# EAGLE design SatNOGSBoardV1 (EAGLE 6.4)
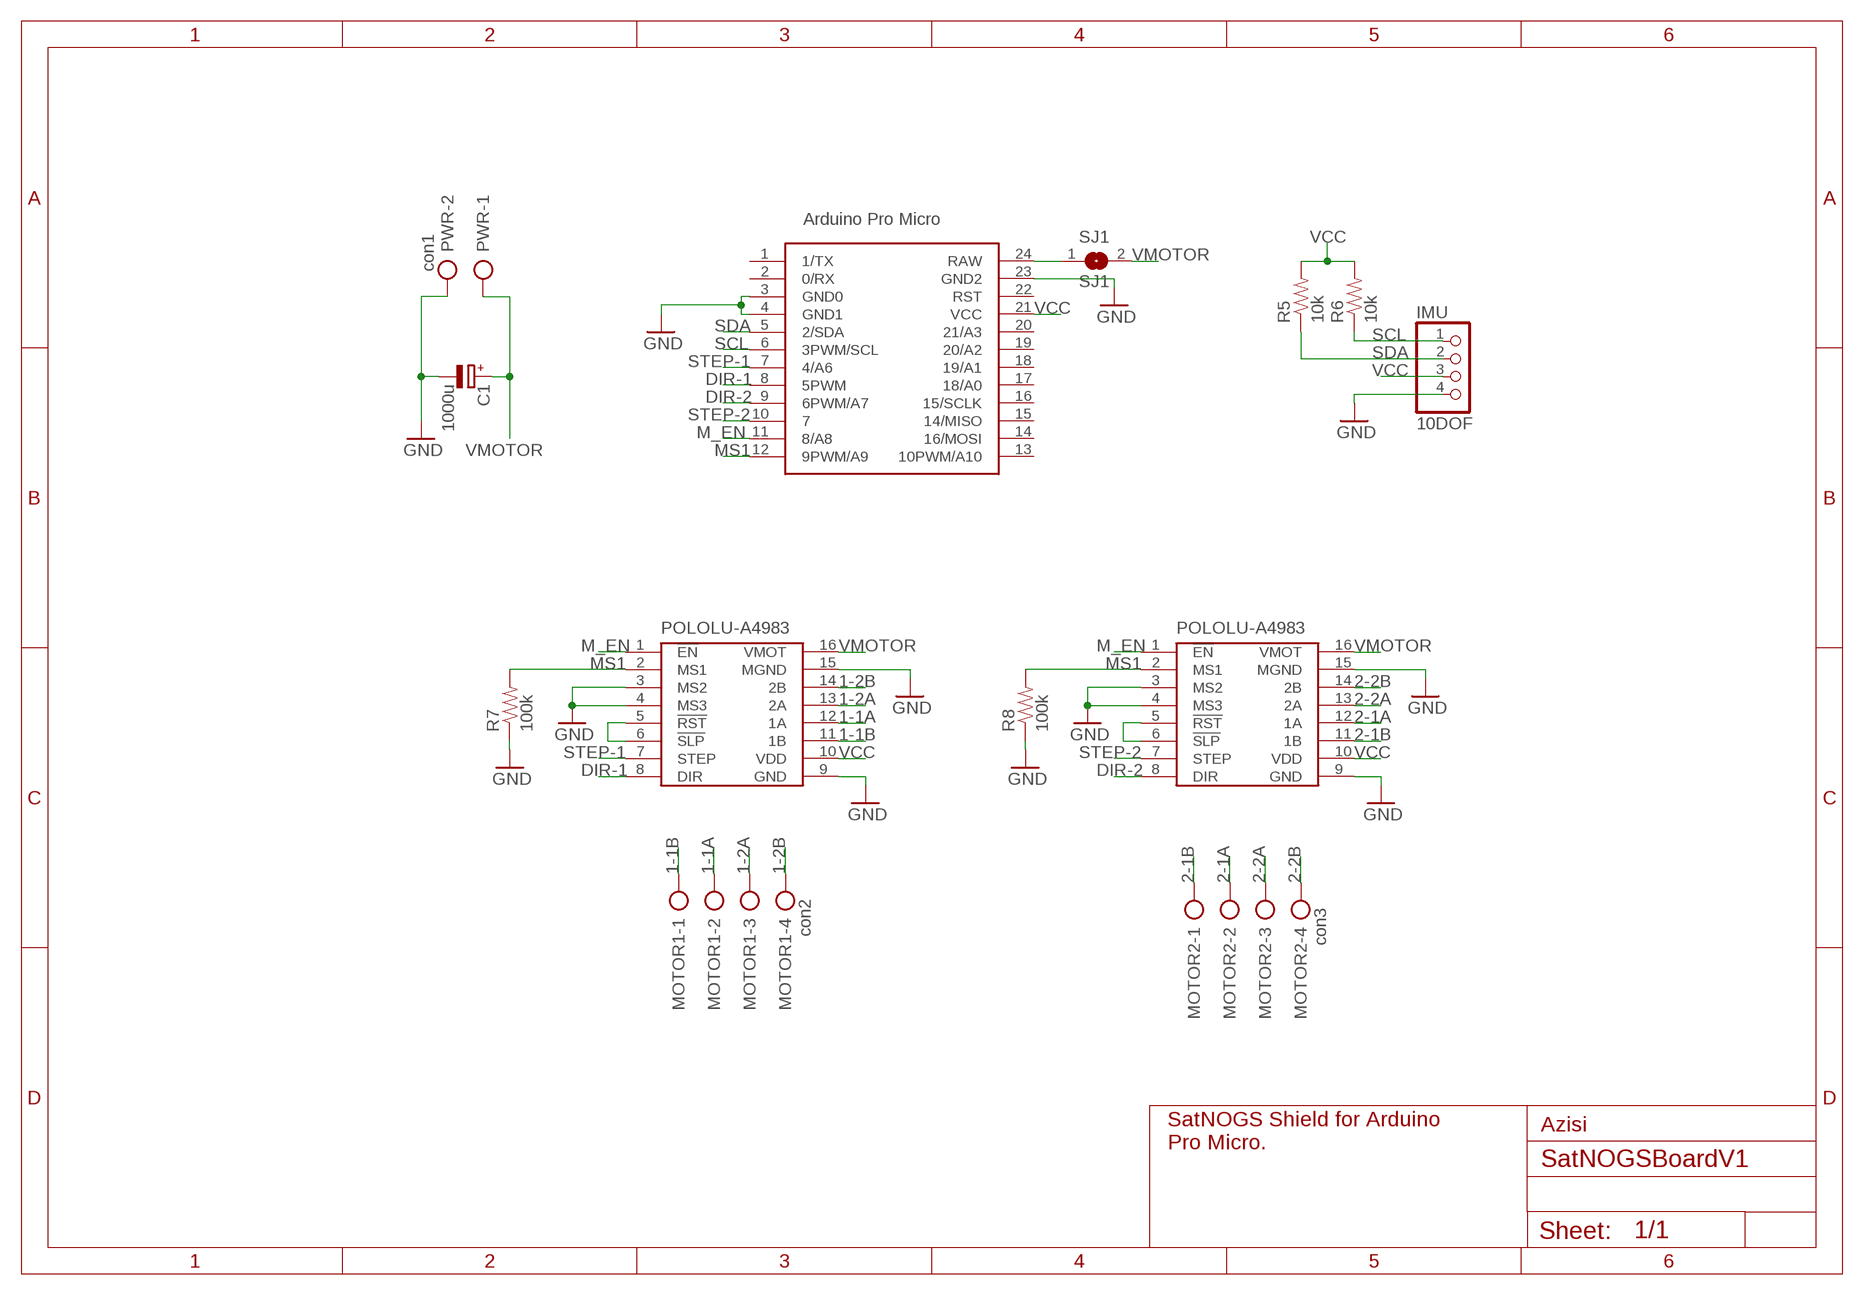
[diagram p0: schematic, sheet 1]

## Parts
C1  1000u  CPOL-EUE5-8.5  [E5-8,5]
DRIVER1  POLOLU-A4983POLOLU-A4983  [POLOLU-A4983]
DRIVER2  POLOLU-A4983POLOLU-A4983  [POLOLU-A4983]
IMU  10DOF  PINHD-1X4/90  [1X04/90]
MOTOR1  con2  AK500/4  [AK500/4]
MOTOR2  con3  AK500/4  [AK500/4]
PWR  con1  AK500/2  [AK500/2]
R5  10k  RESISTORPTH-1/4W  [AXIAL-0.4]
R6  10k  RESISTORPTH-1/4W  [AXIAL-0.4]
R7  100k  RESISTORPTH-1/4W  [AXIAL-0.4]
R8  100k  RESISTORPTH-1/4W  [AXIAL-0.4]
SJ1  SJ1  SJW  [SJW]
UC  ARDUINO_PRO_MICROARDUINO_BOARD  [ARDUINO_MICRO_PRO]

## Nets
1-1A: DRIVER1.12(1A) MOTOR1.2
1-1B: DRIVER1.11(1B) MOTOR1.1
1-2A: DRIVER1.13(2A) MOTOR1.3
1-2B: DRIVER1.14(2B) MOTOR1.4
2-1A: DRIVER2.12(1A) MOTOR2.2
2-1B: DRIVER2.11(1B) MOTOR2.1
2-2A: DRIVER2.13(2A) MOTOR2.3
2-2B: DRIVER2.14(2B) MOTOR2.4
DIR-1: DRIVER1.8(DIR) UC.8(5PWM)
DIR-2: DRIVER2.8(DIR) UC.9(6PWM/A7)
GND: C1.- DRIVER1.3(MS2) DRIVER1.4(MS3) DRIVER1.9(GND) DRIVER1.15(MGND) DRIVER2.3(MS2) DRIVER2.4(MS3) DRIVER2.9(GND) DRIVER2.15(MGND) IMU.4 PWR.2 R7.P$1 R8.P$1 UC.3(GND0) UC.4(GND1) UC.23(GND2)
M_EN: DRIVER1.1(!EN) DRIVER2.1(!EN) UC.11(8/A8)
MS1: DRIVER1.2(MS1) DRIVER2.2(MS1) R7.P$2 R8.P$2 UC.12(9PWM/A9)
N$1: DRIVER1.5(!RST) DRIVER1.6(!SLP)
N$2: DRIVER2.5(!RST) DRIVER2.6(!SLP)
N$3: SJ1.1 UC.24(RAW)
SCL: IMU.1 R6.P$1 UC.6(3PWM/SCL)
SDA: IMU.2 R5.P$1 UC.5(2/SDA)
STEP-1: DRIVER1.7(STEP) UC.7(4/A6)
STEP-2: DRIVER2.7(STEP) UC.10
VCC: DRIVER1.10(VDD) DRIVER2.10(VDD) IMU.3 R5.P$2 R6.P$2 UC.21(VCC)
VMOTOR: C1.+ DRIVER1.16(VMOT) DRIVER2.16(VMOT) PWR.1 SJ1.2
Unconnected: UC.1(1/TX) UC.2(0/RX) UC.13(10PWM/A10) UC.14(16/MOSI) UC.15(14/MISO) UC.16(15/SCLK) UC.17(18/A0) UC.18(19/A1) UC.19(20/A2) UC.20(21/A3) UC.22(RST)

## Notes on the sheet
- Azisi
- SatNOGS Shield for Arduino
  Pro Micro.

## Library data of the parts
C1 = rcl:CPOL-EU: POLARIZED CAPACITOR, European symbol
DRIVER1 DRIVER2 = Pololu-A4983:POLOLU-A4983
IMU = pinhead:PINHD-1X4: PIN HEADER
MOTOR1 MOTOR2 = con-ptr500:AK500/4: CONNECTOR; OC_FARNELL: unknown; OC_NEWARK: unknown
PWR = con-ptr500:AK500/2: CONNECTOR; OC_FARNELL: unknown; OC_NEWARK: unknown
R5-R8 = SparkFun-Resistors:RESISTOR: Resistor Basic schematic elements and footprints for 0603, 1206, and PTH resistors.
SJ1 = jumper:SJ: SMD solder JUMPER
UC = Arduino_Pro_Micro:ARDUINO_PRO_MICRO

## Board
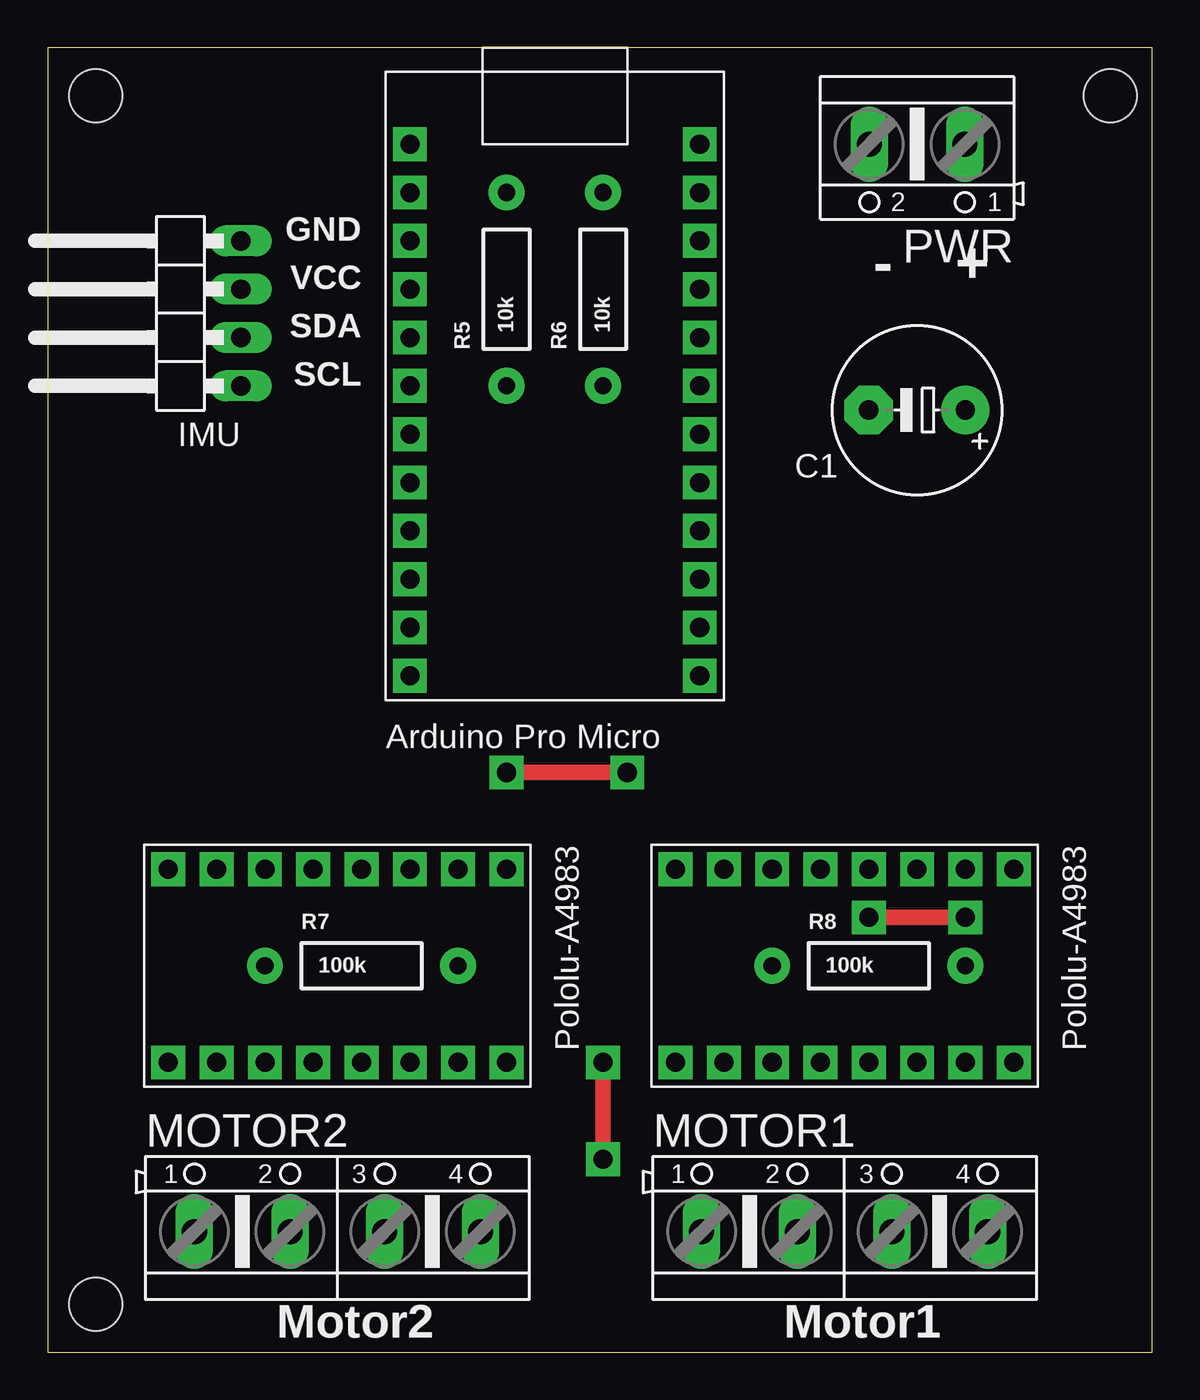
[diagram p1: board, top side]
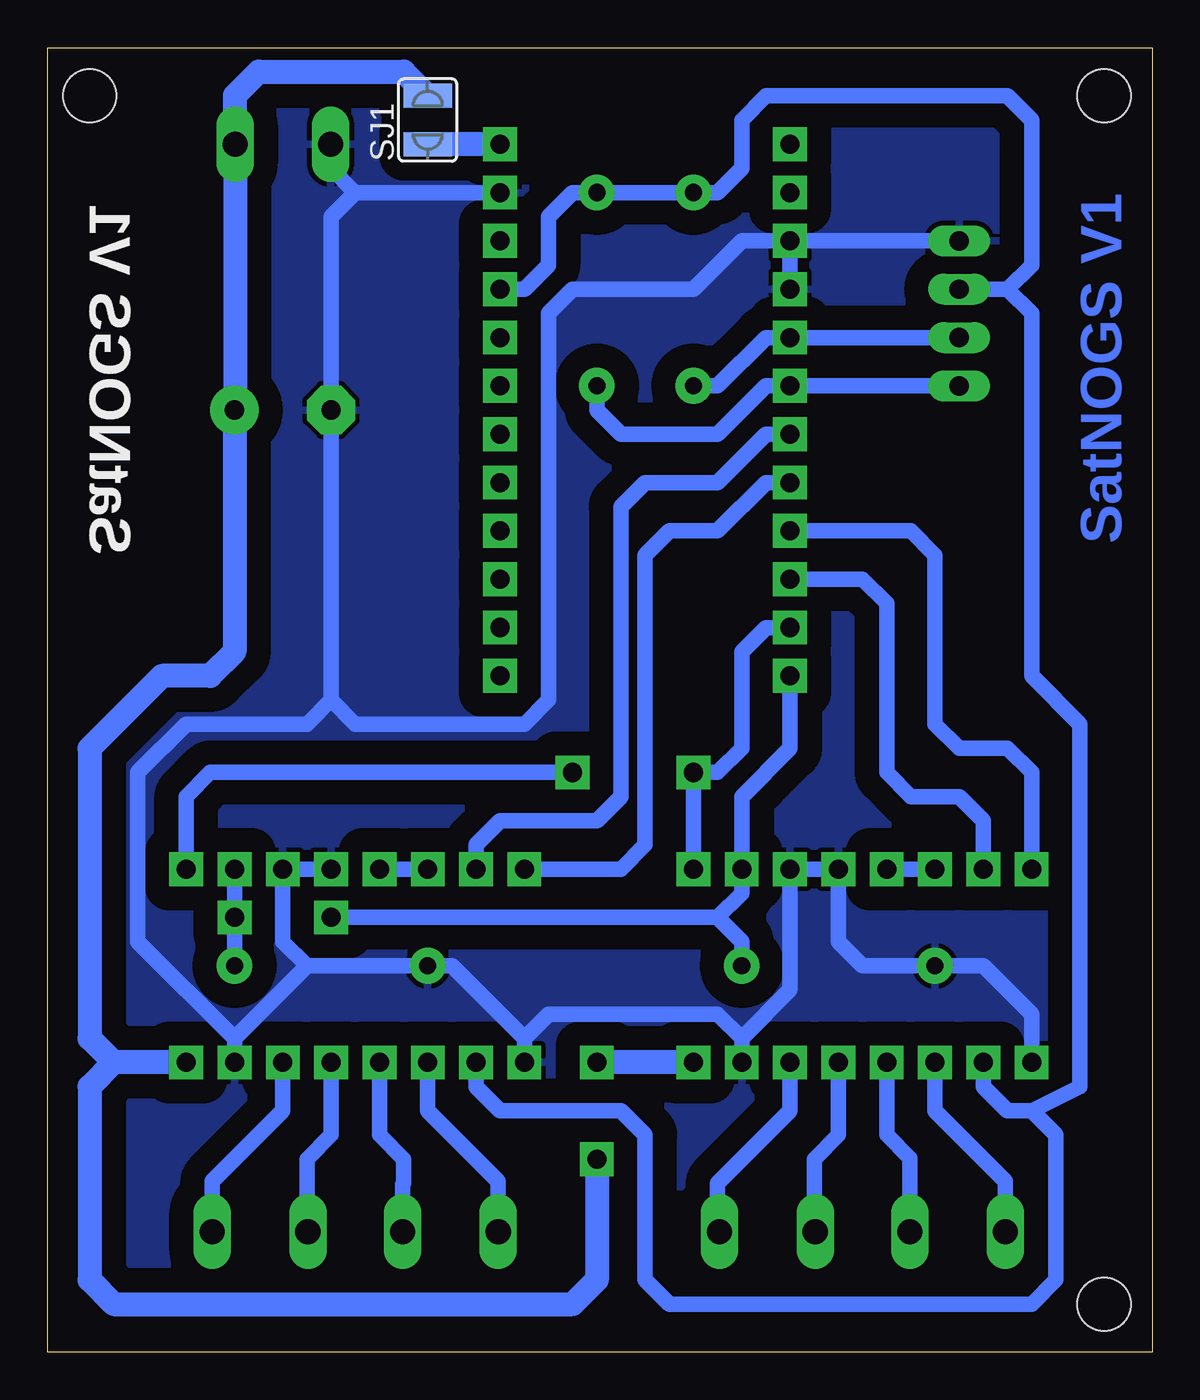
[diagram p2: board, bottom side, seen from below]

Size 58.09 x 68.57 mm. Coordinates in mm from the lower left corner, seen from the top.
Outline: 0,0 58.09,0 58.09,68.57 0,68.57 0,0
Copper layers (1*16): Top 0.035mm / dielectric 1.5mm / Bottom 0.035mm
Design rules "SparkFun": minimum track width 8mil, minimum drill 20mil, track to track 8mil, track to pad 8mil, pad to pad 8mil, via to via 8mil, smd to smd 8mil, copper to edge 8mil, drill to drill 8mil, minimum pad ring 12mil, minimum via ring 10mil, stop-mask expansion 4mil, vias tented up to drill 20mil, thermal gap 10mil
Holes 2.8 mm at 2.54,66.04 55.88,66.04 2.54,2.54

### Footprints (pad centres in the part's own frame; a part is rotated, then mirrored left to right if it is on the bottom)
E5-8,5 = drill 1.016 pad 2.54: + -2.54,0 | drill 1.016 pad 2.54 octagon: - 2.54,0
POLOLU-A4983 = drill 1 pad 1.778 square: 1 -5.08,8.89; 2 -5.08,6.35; 3 -5.08,3.81; 4 -5.08,1.27; 5 -5.08,-1.27; 6 -5.08,-3.81; 7 -5.08,-6.35; 8 -5.08,-8.89; 9 5.08,-8.89; 10 5.08,-6.35; 11 5.08,-3.81; 12 5.08,-1.27; 13 5.08,1.27; 14 5.08,3.81; 15 5.08,6.35; 16 5.08,8.89
1X04/90 = drill 1.016 long: 1 -3.81,-3.81; 2 -1.27,-3.81; 3 1.27,-3.81; 4 3.81,-3.81
AK500/4 = drill 1.321 long: 1 -7.518,0; 2 -2.489,0; 3 2.489,0; 4 7.518,0
AK500/2 = drill 1.321 long: 1 -2.515,0; 2 2.515,0
AXIAL-0.4 = drill 0.9 pad 1.88: P$1 -5.08,0; P$2 5.08,0
SJW = smd 1.27 x 2.54: 1 -1.27,0; 2 1.27,0
ARDUINO_MICRO_PRO = drill 1 pad 1.778 square: 1 -7.62,12.7; 2 -7.62,10.16; 3 -7.62,7.62; 4 -7.62,5.08; 5 -7.62,2.54; 6 -7.62,0; 7 -7.62,-2.54; 8 -7.62,-5.08; 9 -7.62,-7.62; 10 -7.62,-10.16; 11 -7.62,-12.7; 12 -7.62,-15.24; 13 7.62,-15.24; 14 7.62,-12.7; 15 7.62,-10.16; 16 7.62,-7.62; 17 7.62,-5.08; 18 7.62,-2.54; 19 7.62,0; 20 7.62,2.54; 21 7.62,5.08; 22 7.62,7.62; 23 7.62,10.16; 24 7.62,12.7

### Placement (x,y rotation side)
C1  45.72,49.53 180 top
DRIVER1  41.91,20.32 270 top
DRIVER2  15.24,20.32 270 top
IMU  6.35,54.61 90 top
MOTOR1  41.91,6.35 0 top
MOTOR2  15.24,6.35 0 top
PWR  45.72,63.5 180 top
R5  24.13,55.88 90 top
R6  29.21,55.88 90 top
R7  16.51,20.32 0 top
R8  43.18,20.32 0 top
SJ1  38.1,64.77 90 bottom
UC  26.67,50.8 0 top

### Tracks (layer width: path | path; a pad name or v marks a point on that pad's centre or on a via)
1-1A
  Bottom 0.813: MOTOR1.2 39.42,8.84 39.37,8.89 39.37,10.16 40.64,11.43 DRIVER1.12
1-1B
  Bottom 0.813: MOTOR1.1 34.39,8.99 38.1,12.7 DRIVER1.11
1-2A
  Bottom 0.813: DRIVER1.13 43.18,11.43 44.45,10.16 44.45,6.4 MOTOR1.3
1-2B
  Bottom 0.813: MOTOR1.4 49.43,8.99 45.72,12.7 DRIVER1.14
2-1A
  Bottom 0.813: MOTOR2.2 12.75,10.21 13.97,11.43 DRIVER2.12
2-1B
  Bottom 0.813: MOTOR2.1 7.72,8.99 11.43,12.7 DRIVER2.11
2-2A
  Bottom 0.813: DRIVER2.13 16.51,11.43 17.78,10.16 17.78,6.4 MOTOR2.3
2-2B
  Bottom 0.813: DRIVER2.14 19.05,12.7 22.86,8.89 22.86,6.45 MOTOR2.4
DIR-1
  Bottom 0.813: DRIVER1.8 27.94,25.4 26.67,26.67 26.67,41.91 25.4,43.18 22.86,43.18 20.32,45.72 UC.8
DIR-2
  Bottom 0.813: UC.9 12.7,43.18 11.43,41.91 11.43,33.02 10.16,31.75 7.62,31.75 6.35,30.48 DRIVER2.8
GND
  Bottom 0.813: UC.4 UC.3 | PWR.2 43.2,62.26 41.91,60.96 | 41.91,60.96 UC.23 | 41.91,60.96 43.18,59.69 C1.- 43.18,34.29 | DRIVER1.4 DRIVER1.3 45.72,21.59 44.45,20.32 | DRIVER2.9 6.35,17.78 8.89,20.32 R7.P$1 15.24,20.32 16.51,21.59 DRIVER2.4 DRIVER2.3 19.05,19.05 21.59,16.51 | DRIVER2.15 21.59,16.51 | 21.59,16.51 22.86,17.78 31.75,17.78 33.02,16.51 | 33.02,16.51 DRIVER1.9 | 48.26,16.51 DRIVER1.15 | 44.45,20.32 R8.P$1 36.83,20.32 33.02,16.51 | 44.45,20.32 48.26,16.51 | 43.18,34.29 44.45,33.02 50.8,33.02 53.34,30.48 53.34,21.59 48.26,16.51 | UC.3 21.59,58.42 24.13,55.88 30.48,55.88 31.75,54.61 31.75,34.29 33.02,33.02 41.91,33.02 43.18,34.29 | IMU.4 UC.3
  pour Bottom (isolate 1.27): 0,68.58 0,0 58.42,0 58.42,68.58
M_EN  (via drill 1 pad 1.78)
  Top 0.813: v30.48,30.48 v24.13,30.48
  Bottom 0.813: DRIVER2.1 v24.13,30.48 22.86,30.48 21.59,31.75 21.59,36.83 20.32,38.1 UC.11 | DRIVER1.1 50.8,29.21 49.53,30.48 v30.48,30.48
MS1  (via drill 1 pad 1.78)
  Top 0.813: v43.18,22.86 v48.26,22.86
  Bottom 0.813: UC.12 19.05,31.75 21.59,29.21 DRIVER2.2 21.59,24.13 22.86,22.86 | R8.P$2 v48.26,22.86 DRIVER1.2 | R7.P$2 21.59,21.59 22.86,22.86 | v43.18,22.86 22.86,22.86
N$1
  Bottom 0.813: DRIVER1.6 DRIVER1.5
N$2
  Bottom 0.813: DRIVER2.6 DRIVER2.5
N$3
  Bottom 1.27: UC.24 SJ1.1
SCL
  Bottom 0.813: IMU.1 UC.6 20.32,50.8 22.86,48.26 27.94,48.26 29.21,49.53 R6.P$1
SDA
  Bottom 0.813: IMU.2 UC.5 20.32,53.34 22.86,50.8 R5.P$1
STEP-1
  Bottom 0.813: DRIVER1.7 35.56,26.67 34.29,27.94 29.21,27.94 27.94,29.21 27.94,44.45 26.67,45.72 22.86,45.72 20.32,48.26 UC.7
STEP-2
  Bottom 0.813: UC.10 15.24,40.64 13.97,39.37 13.97,30.48 12.7,29.21 10.16,29.21 8.89,27.94 DRIVER2.7
VCC
  Bottom 0.813: DRIVER2.10 8.89,13.97 7.62,12.7 6.35,12.7 | 6.35,12.7 5.08,11.43 5.08,3.81 6.35,2.54 25.4,2.54 26.67,3.81 26.67,11.43 27.94,12.7 34.29,12.7 35.56,13.97 DRIVER1.10 | 6.35,12.7 3.81,13.97 3.81,33.02 6.35,35.56 6.35,54.61 7.62,55.88 | UC.21 33.02,55.88 31.75,57.15 31.75,59.69 30.48,60.96 R6.P$2 R5.P$2 22.86,60.96 21.59,62.23 21.59,64.77 20.32,66.04 7.62,66.04 6.35,64.77 6.35,57.15 7.62,55.88 | IMU.3 7.62,55.88
VMOTOR  (via drill 1 pad 1.78)
  Top 0.813: v29.21,15.24 v29.21,10.16
  Bottom 0.813: 48.23,49.55 C1.+
  Bottom 1.27: 48.23,49.55 PWR.1 48.23,66.06 46.99,67.31 39.37,67.31 SJ1.2 | 54.61,15.24 55.88,16.51 55.88,31.75 52.07,35.56 49.53,35.56 48.26,36.83 C1.+ | DRIVER1.16 54.61,15.24 | DRIVER2.16 v29.21,15.24 | v29.21,10.16 29.21,3.81 30.48,2.54 54.61,2.54 55.88,3.81 55.88,13.97 54.61,15.24

### Text on the board
Bottom: SatNOGS V1
tPlace: GND | - | + | VCC | SDA | SCL | Motor2 | Motor1
bPlace: SatNOGS V1